# Altium schematic sheet SUNNYMultiAnalyzor.SchDoc: <?>
size 420 x 297 mm; ApprovedBy: <?>; CheckedBy: <?>; CompanyName: ISON IMPORT-EXPORT COMPANY LIMITED; DrawnBy: <?>; DocumentNumber: <?>; Revision: <?>; SheetNumber: <?>; SheetTotal: <?>; Size: A3; ISON_Model: <?>
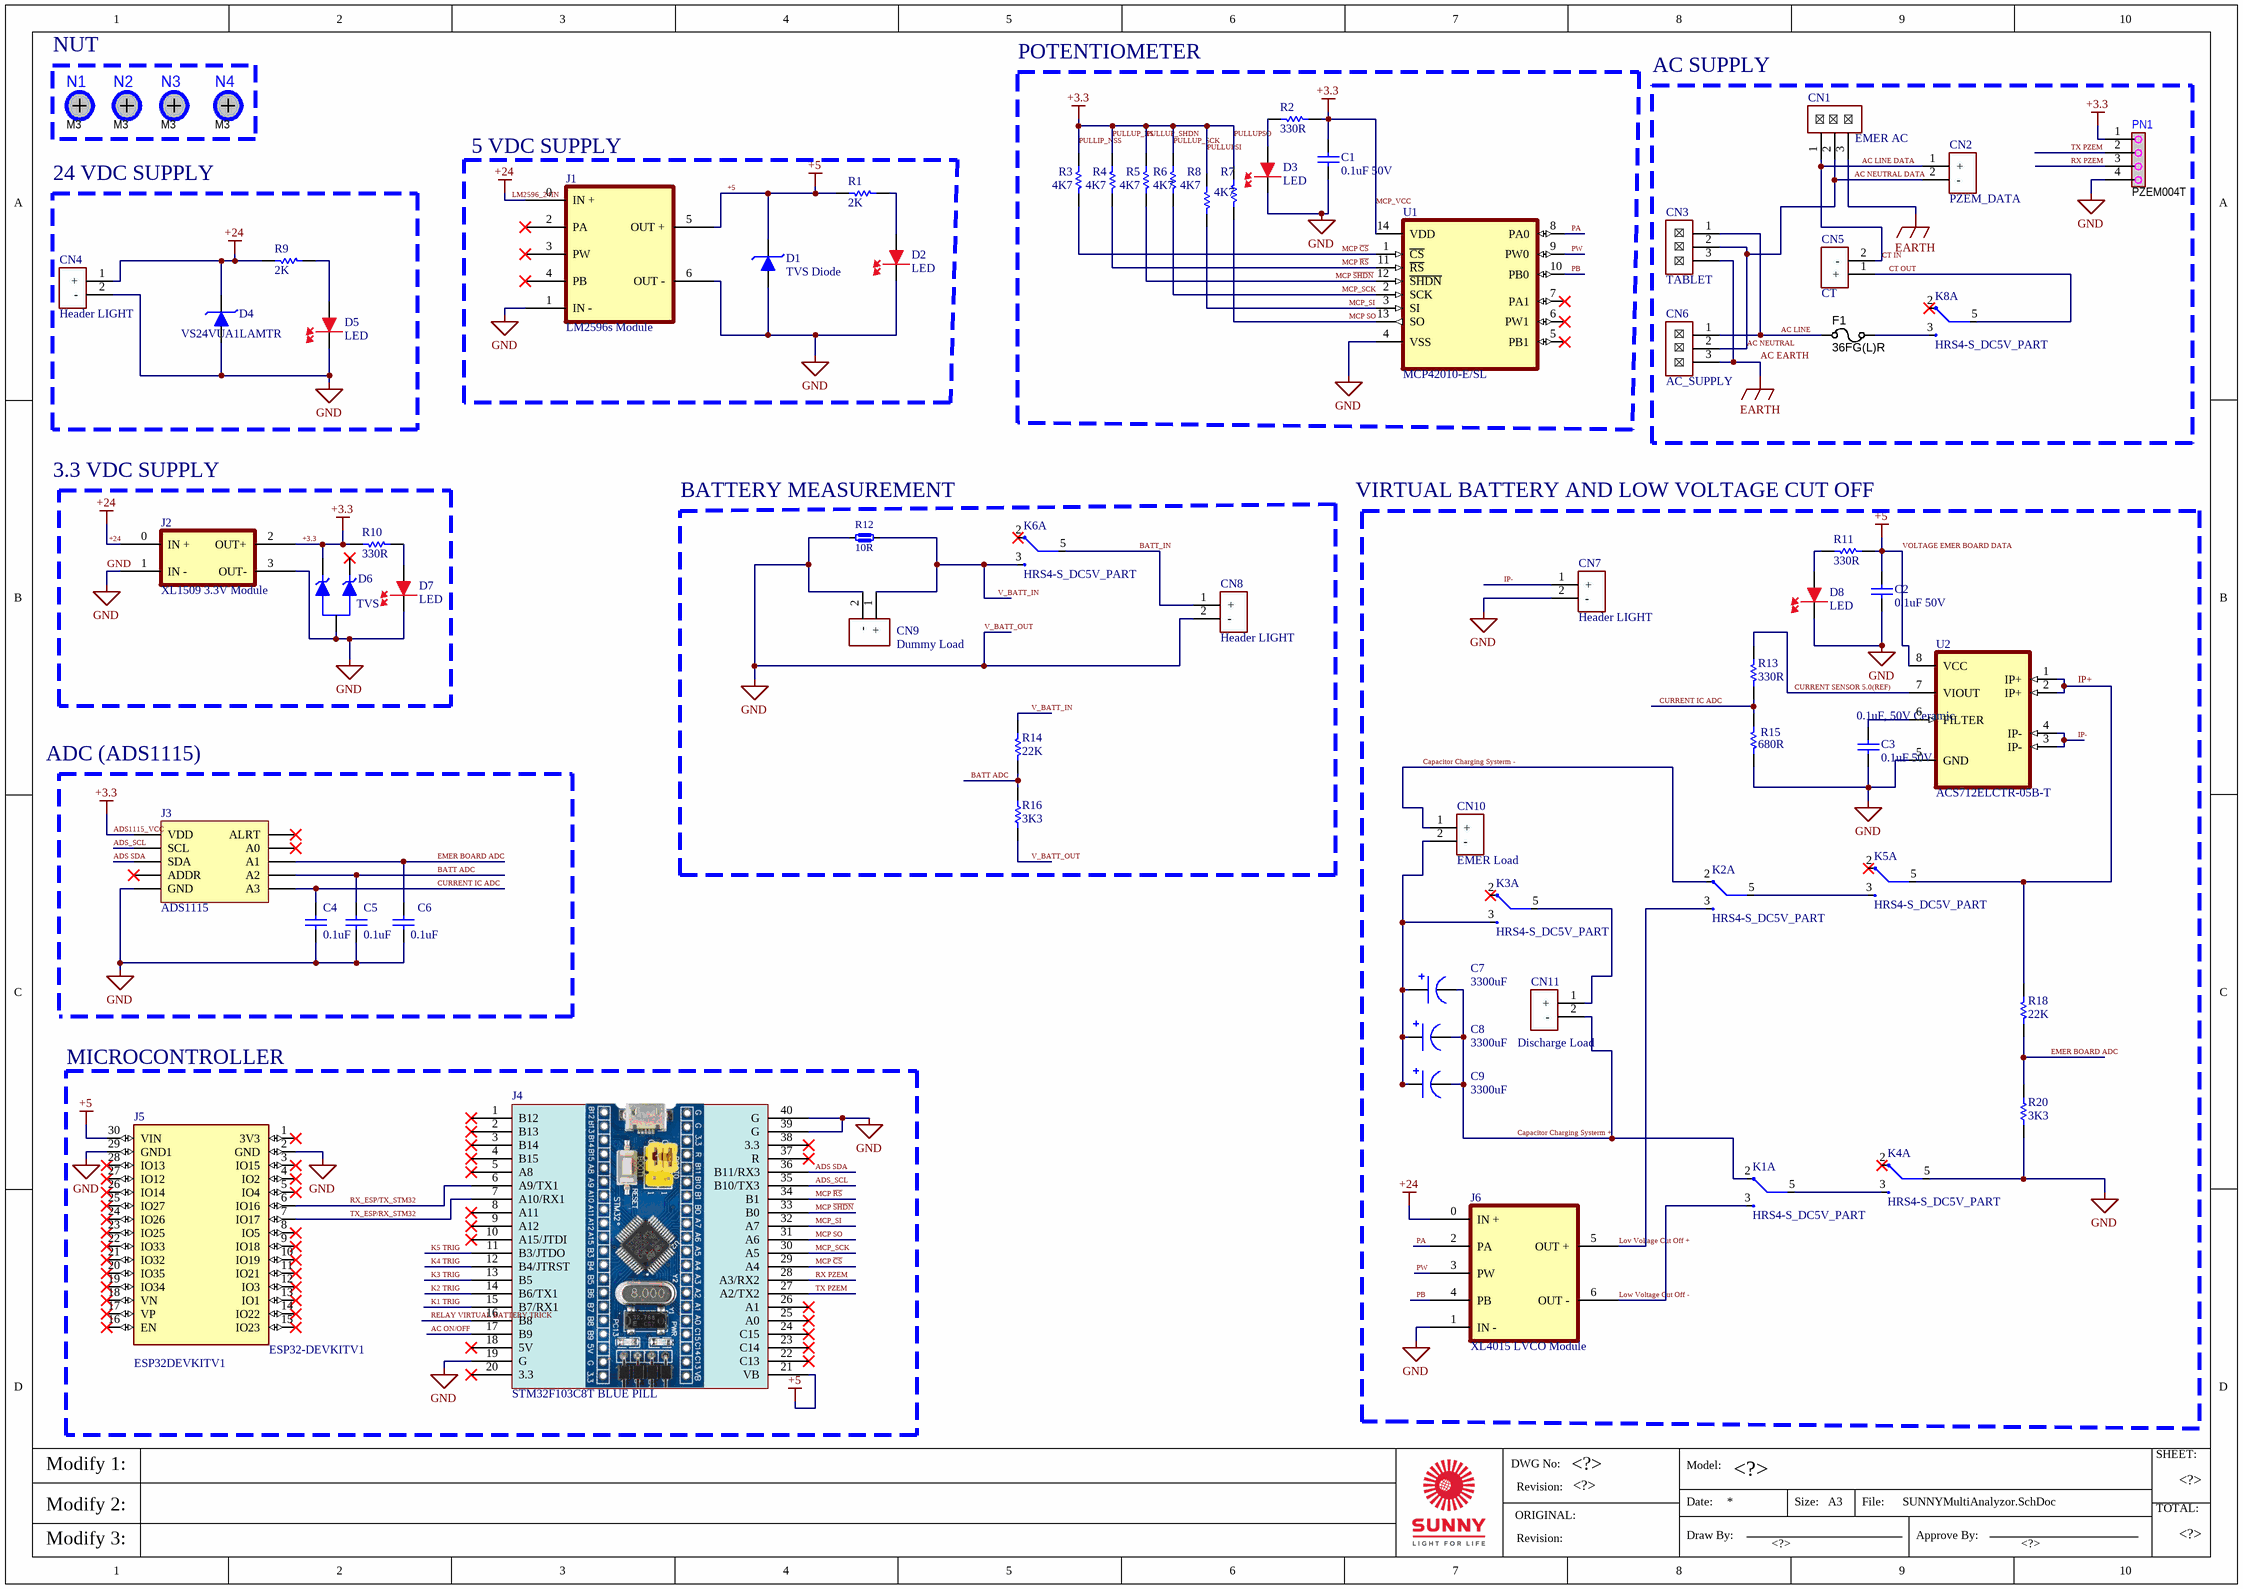
[diagram p0: SUNNYMultiAnalyzor.SchDoc]

## Parts
C1  0.1uF 50V  [CAPC2012X135N]
C2  0.1uF 50V  [CAPC2012X135N]
C3  0.1uF 50V  value 0.1uF, 50V Ceramic  [CAPC2012X135N]
C4  0.1uF  [CAPC2012X135N]
C5  0.1uF  [CAPC2012X135N]
C6  0.1uF  [CAPC2012X135N]
C7  3300uF  [CAP3300]
C8  3300uF  [CAP3300]
C9  3300uF  [CAP3300]
CN1  EMER AC  [CON 3P 3.8mm]
CN2  PZEM_DATA  [Header 2 pin molex]
CN3  TABLET  [CON 3P 3.8mm]
CN4  Header LIGHT  [HEADER 2 PIN MOLEX POLE]
CN5  CT  [Header 2 pin molex]
CN6  AC_SUPPLY  [CON 3P 3.8mm]
CN7  Header LIGHT  [HEADER 2 PIN MOLEX POLE]
CN8  Header LIGHT  [HEADER 2 PIN MOLEX POLE]
CN9  Dummy Load  [Header 2 pin molex]
CN10  EMER Load  [Header 2 pin molex]
CN11  Discharge Load  [Header 2 pin molex]
D1  TVS Diode  [SOD-128]
D2  LED  [0805 LED]
D3  LED  [0805 LED]
D4  VS24VUA1LAMTR  [SOD-128]
D5  LED  [0805 LED]
D6  TVS  [SOT95P237X111-3N]
D7  LED  [0805 LED]
D8  LED  [0805 LED]
F1  36FG(L)R  [Micro Fuse - L14mm]
J1  LM2596s Module  [LM2596s MODULE]
J2  XL1509 3.3V Module  [XL1509 MODULE]
J3  ADS1115  [BNO080]
J4  STM32F103C8T BLUE PILL  [STM32F103 BLUE PILL]
J5  ESP32DEVKITV1  [ESP32-DEVKITV1_3D]
J6  XL4015 LVCO Module  [XL4015 Module]
K1  HRS4-S_DC5V_PART  [HRS4SDC5V]  (part A of 2)
K2  HRS4-S_DC5V_PART  [HRS4SDC5V]  (part A of 2)
K3  HRS4-S_DC5V_PART  [HRS4SDC5V]  (part A of 2)
K4  HRS4-S_DC5V_PART  [HRS4SDC5V]  (part A of 2)
K5  HRS4-S_DC5V_PART  [HRS4SDC5V]  (part A of 2)
K6  HRS4-S_DC5V_PART  [HRS4SDC5V]  (part A of 2)
K8  HRS4-S_DC5V_PART  [HRS4SDC5V]  (part A of 2)
N1  M3  [M3 hole]
N2  M3  [M3 hole]
N3  M3  [M3 hole]
N4  M3  [M3 hole]
PN1  PZEM004T  [1x4P Test PIN]
R1  2K  [0805 Modificado]
R2  330R  [0805 Modificado]
R3  4K7  [0805 Modificado]
R4  4K7  [0805 Modificado]
R5  4K7  [0805 Modificado]
R6  4K7  [0805 Modificado]
R7  4K7  [0805 Modificado]
R8  4K7  [0805 Modificado]
R9  2K  [0805 Modificado]
R10  330R  [0805 Modificado]
R11  330R  [0805 Modificado]
R12  10R
R13  330R  [0805 Modificado]
R14  22K  [0805 Modificado]
R15  680R  [0603 RESISTOR]
R16  3K3  [1206 RESISTOR]
R18  22K  [0805 Modificado]
R20  3K3  [1206 RESISTOR]
U1  MCP42010-E/SL  [SOIC127P600X175-14N]
U2  ACS712ELCTR-05B-T  [SOIC127P600X175-8N]

## Blocks framed on the sheet
NUT: N1-N4
AC SUPPLY: CN1-CN3 CN5 CN6 F1 K8 PN1
24 VDC SUPPLY: CN4 D4 D5 R9
5 VDC SUPPLY: D1 D2 J1 R1
BATTERY MEASUREMENT: CN8 CN9 K6 R12 R14 R16
MICROCONTROLLER: J4 J5

## Nets
+3.3: C1.2 D6.2(K2) J2.2(OUT+) J3.1(VDD) PN1.1 R2.1 R3.1 R4.1 R5.1 R6.1 R7.1 R8.1 R10.2 U1.14(VDD)  [also labelled ADS1115_VCC, MCP_VCC, PULLIP_NSS, PULLUP_RS, PULLUP_SCK, PULLUP_SHDN, PULLUPSI, PULLUPSO]
+5: C2.2 D1.2(K) J1.5(OUT_+) J4.21(VB) J5.30(VIN) R1.2 R11.1 U2.8(VCC)  [also labelled VOLTAGE EMER BOARD DATA]
+24: CN4.1(+) D4.2(K) J1.0(IN_+) J2.0(IN_+) J6.0(IN_+) R9.2  [also labelled LM2596_24IN]
AC EARTH: CN1.3 CN3.3 CN6.3  [also labelled EARTH]
GND: C1.1 C2.1 C3.1 C4.1 C5.1 C6.1 CN4.2(-) CN7.2(-) CN8.2(-) CN9.2(-) D1.1(A) D2.1(K) D3.1(K) D4.1(A) D5.1(K) D6.3(A) D7.1(K) D8.1(K) J1.1(IN_-) J1.6(OUT_-) J2.1(IN_-) J2.3(OUT-) J3.2(GND) J4.19(G) J4.39(G) J4.40(G) J5.2(GND) J5.29(GND1) J6.1(IN_-) K4.5(COM) PN1.4 R12.1 R15.2 R16.1 R20.2 U1.4(VSS) U2.5(GND)  [also labelled V_BATT_OUT]
AC LINE: CN3.1 CN6.1 F1.1
AC LINE DATA: CN1.1 CN2.1(+) CN5.2(-)  [also labelled CT IN]
AC NEUTRAL: CN1.2 CN2.2(-) CN3.2 CN6.2  [also labelled AC NEUTRAL DATA]
AC ON/OFF: J4.17(B9)
ADS SDA: J3.4(SDA) J4.36(B11/RX3)
ADS_SCL: J3.3(SCL) J4.35(B10/TX3)
BATT ADC: C5.2 J3.9(A2) R14.1 R16.2
BATT_IN: CN8.1(+) K6.5(COM)
Capacitor Charging Systerm +: C7.N C8.N C9.N CN11.2(-) K1.2(NC)
Capacitor Charging Systerm -: CN10.1(+) K2.2(NC)
CT OUT: CN5.1(+) K8.5(COM)
CURRENT IC ADC: C4.2 J3.10(A3) R13.2 R15.1
CURRENT SENSOR 5.0(REF): R13.1 U2.7(VIOUT)
EMER BOARD ADC: C6.2 J3.8(A1) R18.2 R20.1
IP+: K5.5(COM) R18.1 U2.1(IP+) U2.2(IP+)
IP-: CN7.1(+) U2.3(IP-) U2.4(IP-)
K1 TRIG: J4.15(B7/RX1)
K2 TRIG: J4.14(B6/TX1)
K3 TRIG: J4.13(B5)
K4 TRIG: J4.12(B4/JTRST)
K5 TRIG: J4.11(B3/JTDO)
Lov Voltage Cut Off +: J6.5(OUT_+) K2.3(NO)
Low Voltage Cut Off -: J6.6(OUT_-) K1.3(NO)
MCP ~{CS}: J4.29(A4) R3.2 U1.1(~{CS})
MCP ~{RS}: J4.34(B1) R4.2 U1.11(~{RS})
MCP ~{SHDN}: J4.33(B0) R5.2 U1.12(~{SHDN})
MCP SO: J4.31(A6) R7.2 U1.13(SO)
MCP_SCK: J4.30(A5) R6.2 U1.2(SCK)
MCP_SI: J4.32(A7) R8.2 U1.3(SI)
PA: J6.2(PA) U1.8(PA0)
PB: J6.4(PB) U1.10(PB0)
PW: J6.3(PW) U1.9(PW0)
RELAY VIRTUAL BATTERY TRICK: J4.16(B8)
RX PZEM: J4.28(A3/RX2) PN1.3
RX_ESP/TX_STM32: J4.6(A9/TX1) J5.6(IO16)
TX PZEM: J4.27(A2/TX2) PN1.2
TX_ESP/RX_STM32: J4.7(A10/RX1) J5.7(IO17)
V_BATT_IN: CN9.1(+) K6.3(NO) R12.2 R14.2
NetC3_2: C3.2 U2.6(FILTER)
NetC7_P: C7.P C8.P C9.P CN10.2(-) K3.3(NO)
NetCN11_1: CN11.1(+) K3.5(COM)
NetD2_2: D2.2(A) R1.1
NetD3_2: D3.2(A) R2.2
NetD5_2: D5.2(A) R9.1
NetD7_2: D7.2(A) R10.1
NetD8_2: D8.2(A) R11.2
NetF1_2: F1.2 K8.3(NO)
NetK1_5: K1.5(COM) K4.3(NO)
NetK2_5: K2.5(COM) K5.3(NO)

Not connected (* = marked no-connect by the designer): D6 1(K1)*; J1 2(PA)* 3(PW)* 4(PB)*; J3 5(ADDR)* 6(ALRT)* 7(A0)*; J4 1(B12)* 2(B13)* 3(B14)* 4(B15)* 5(A8)* 8(A11)* 9(A12)* 10(A15/JTDI)* 18(5V)* 20(3.3)* 22(C13)* 23(C14)* 24(C15)* 25(A0)* 26(A1)* 37(R)* 38(3.3)*; J5 1(3V3)* 3(IO15)* 4(IO2)* 5(IO4)* 8(IO5)* 9(IO18)* 10(IO19)* 11(IO21)* 12(IO3)* 13(IO1)* 14(IO22)* 15(IO23)* 16(EN)* 17(VP)* 18(VN)* 19(IO34)* 20(IO35)* 21(IO32)* 22(IO33)* 23(IO25)* 24(IO26)* 25(IO27)* 26(IO14)* 27(IO12)* 28(IO13)*; K3 2(NC)*; K4 2(NC)*; K5 2(NC)*; K6 2(NC)*; K8 2(NC)*; U1 5(PB1)* 6(PW1)* 7(PA1)*

## Notes on the sheet
- POTENTIOMETER
- 3.3 VDC SUPPLY
- VIRTUAL BATTERY AND LOW VOLTAGE CUT OFF
- ADC (ADS1115)
- Modify 1:
- DWG No:
- Model:
- SHEET:
- Modify 2:
- ORIGINAL:
- Revision:
- Date:
- Draw By:
- Size:
- File:
- Approve By:
- TOTAL:
- Modify 3:
- (in symbol ESP32DEVKITV1) ESP32-DEVKITV1

## Library data of the parts
C1 C2 C4-C6 = Capacitor SMD Ceramic Chip Cap 0.1uF 50V (0805) (AVX): RMPN: RMELCCAPSC001; Value: 0.1uF, 50V Ceramic; Created by: Zion Blue; Published: 28 April 2014; Publisher: Cynetik Group; RM DESC: Capacitor SMD Ceramic Chip Cap 0.1uF 50V (0805) (AVX); MPN: *; Manufacturer: *
C3 = Capacitor SMD Ceramic Chip Cap 0.1uF 50V (0805) (AVX): RMPN: RMELCCAPSC001; Created by: Zion Blue; Published: 28 April 2014; Publisher: Cynetik Group; RM DESC: Capacitor SMD Ceramic Chip Cap 0.1uF 50V (0805) (AVX); MPN: *; Manufacturer: *
C7-C9 = Electrolytic Capacitor: 3300 uF / 50 Vdc
CN1 CN3 CN6 = Con 112002ST/RH 3.96mm 2P V-PLUG_1: Connector 3.9mm. 3PINS WAFER STRAIGHT PIN (MALE); RMPN: RMELCCNT006; Manufacturer: GTK; RM DESC: Connector 3.9mm. 2PINS WAFER STRAIGHT PIN (MALE); ESPN: 0007-0932-2; M DESC: WAFER Connector 2 Pins,Pitch 3.96mm, Straight Type; MPN: 112002ST/RH; ComponentLink1Description: ES LINK; ComponentLink1URL: https://www.es.co.th/detail.asp?Prod=000709322
CN2 CN5 CN9-CN11 = Header LIGHT: Connector 3.96MM 02 PIN WAFER STRAIGHTPIN (MALE)
CN4 CN7 CN8 = CON Header LIGHT Pole: Connector 3.96MM 02 PIN WAFER STRAIGHTPIN (MALE)
D1 = TVS Diode VS6V0UA1LAMTR: TVS Diode VS6V0UA1LAMTR . Breakdown Voltage = 7.02 V , Clamping Voltage 10.3 V , Working Reverse Standoff Voltage 6V; Published: 8-Jun-2000; LatestRevisionDate: 17-Jul-2002; LatestRevisionNote: Re-released for DXP Platform.; DatasheetVersion: 1998; PackageVersion: Aug-1999; PackageReference: DO-41; Publisher: Altium Limited; PackageDescription: Diode, Axial; Body 5.2 x 2.7 mm (LxDia. max), Lead Dia. 0.86 mm (max); Code_JEDEC: DO-204-AL; ComponentLink1Description: Manufacturer Link; ComponentLink1URL: http://www.fairchildsemi.com/; ComponentLink2Description: Datasheet; ComponentLink2URL: http://www.fairchildsemi.com/ds/1N%2F1N4001.pdf
D2 D3 D5 D7 D8 = LED RED (SMD): LED SMD  mcd,Red Color Red Diffused Lens
D4 = TVS Diode VS24VUA1LAMTR: TVS Diode VS24VUA1LAMTR . Breakdown Voltage = 28.1 V , Clamping Voltage 38.9 V , Working Reverse Standoff Voltage 24V; Published: 8-Jun-2000; LatestRevisionDate: 17-Jul-2002; LatestRevisionNote: Re-released for DXP Platform.; DatasheetVersion: 1998; PackageVersion: Aug-1999; PackageReference: DO-41; Publisher: Altium Limited; PackageDescription: Diode, Axial; Body 5.2 x 2.7 mm (LxDia. max), Lead Dia. 0.86 mm (max); Code_JEDEC: DO-204-AL; ComponentLink1Description: Manufacturer Link; ComponentLink1URL: http://www.fairchildsemi.com/; ComponentLink2Description: Datasheet; ComponentLink2URL: http://www.fairchildsemi.com/ds/1N%2F1N4001.pdf
D6 = TVS Diode MMBZ6V8ALT1G: 46V Clamp 870mA Ipp Tvs Diode Surface Mount SOT-23-3 (TO-236); Package: None; Price: None; Value: *; MP: MMBZ6V8ALT1G; Availability: Unavailable
F1 = Fuse 36FG(L)R 1A On pcb: Fuse Microfuse, 1A/250Vac, Fast Acting (Normal Blow) P/N : 36FG(L)R (SLEEK); RMPN: RMELCFUSA001; Revised: Zion Blue; RM DESC: Fuse หางหนู Microfuse, 1A/250Vac, Fast Acting (Normal Blow) P/N : 36FG(L)R (SLEEK); ESPN: 0562-0001-0; Value: 1A, 250Vac; Published: 14-May-2014; Publisher: Cynetik Group; MPN: 36FG(L)R; Manufacturer: SLEEK; ComponentLink1Description: Link ES; ComponentLink1URL: https://www.es.co.th/detail.asp?prod=056200010; ComponentLink2Description: Datasheet; ComponentLink2URL: https://www.es.co.th/Schemetic/PDF/36FG-SLEEK.PDF
J1 = LM2596s Module 5A: LM2596s Module step down converter
J2 = XL1509 Module: XL1509 Module step down converter
J3 = ADS1115: ADC Sensor; LatestRevisionDate: 17-Jul-2002; LatestRevisionNote: Re-released for DXP Platform.; Publisher: Altium Limited
J4 = STM32 BULE PILL: STM32F103C8T BULE PILL
J5 = ESP32DEVKITV1: Dual core, Wi-Fi: 2.4 GHz up to 150 Mbits/s,BLE (Bluetooth Low Energy) and legacy Bluetooth, 32 bits, Up to 240 MHz; MF: Do it; Check_prices: https://www.snapeda.com/parts/ESP32%20DEVKIT%20V1/Do%20it/view-part/5659245/?ref=eda; Value: *; SnapEDA_Link: https://www.snapeda.com/parts/ESP32%20DEVKIT%20V1/Do%20it/view-part/5659245/?ref=snap; Package: Package; Availability: Unavailable; Price: None; MP: ESP32 DEVKIT V1
J6 = XL4015 Module 5A: XL4015 Module step down converter for Low Voltage Cut Off Check(LVCO)
K1-K6 K8 = HRS4-S_DC5V_PART: Relay or Contactor; Manufacturer_Name: MULTICOMP; Manufacturer_Part_Number: HRS4-S DC5V; Datasheet Link: http://www.farnell.com/datasheets/1306711.pdf; Height: 16mm
N1-N4 = M3 hole: น็อต JT หัวร่ม สกรูมิลสี่แฉก M3x6; RMPN: RMRMANUTCJTZ011
PN1 = PIN Header 1X4: Connector Pin Header 4 Pins,Pitch 2.54mm. P/N : PHSS04G10/RH (GTK); ComponentLink1Description: Link ES; ComponentLink1URL: https://www.es.co.th/detail.asp?Prod=000703471; ComponentLink2Description: Datasheet; ComponentLink2URL: https://www.es.co.th/Schemetic/PDF/PHSSXXG10.PDF
R1-R11 R13-R16 R18 R20 = Resistor SMD 330R +/- 1% (CHIP): 'RES SMD 330 OHM 5% 1/8W 0805/0805W8F3300T5E; RMPN: RMELCRSTS010
R12 = Dummy Load: 10 OHM , 40 W . Made by Parallel of 2 Resistor 20 OHM 20 W
U1 = MCP42010-E/SL: Digital Potentiometer 10k Ohm 2 Circuit 256 Taps SPI Interface 14-SOIC; MF: Microchip; Value: *; Price: None; Package: SOIC-14 Microchip; SnapEDA_Link: https://www.snapeda.com/parts/MCP42010-E/SL/Microchip/view-part/386175/?ref=snap; Availability: Unavailable; MP: MCP42010-E/SL
U2 = ACS712ELCTR-05B-T: Current Sensor 5A 1 Channel Hall Effect, Open Loop Bidirectional 8-SOIC (0.154, 3.90mm Width); MF: Allegro MicroSystems LLC; SnapEDA_Link: https://www.snapeda.com/parts/ACS712ELCTR-05B-T/Allegro+MicroSystems+LLC/view-part/?ref=snap; Package: SOIC-8 Allegro MicroSystems LLC; MP: ACS712ELCTR-05B-T; Check_prices: https://www.snapeda.com/parts/ACS712ELCTR-05B-T/Allegro+MicroSystems+LLC/view-part/?ref=eda; Purchase-URL: https://pricing.snapeda.com/search/part/ACS712ELCTR-05B-T/?ref=eda; Price: None; Value: *; Availability: In Stock